# Altium schematic sheet First_Sheet.SCHDOC
size 558 x 431 mm
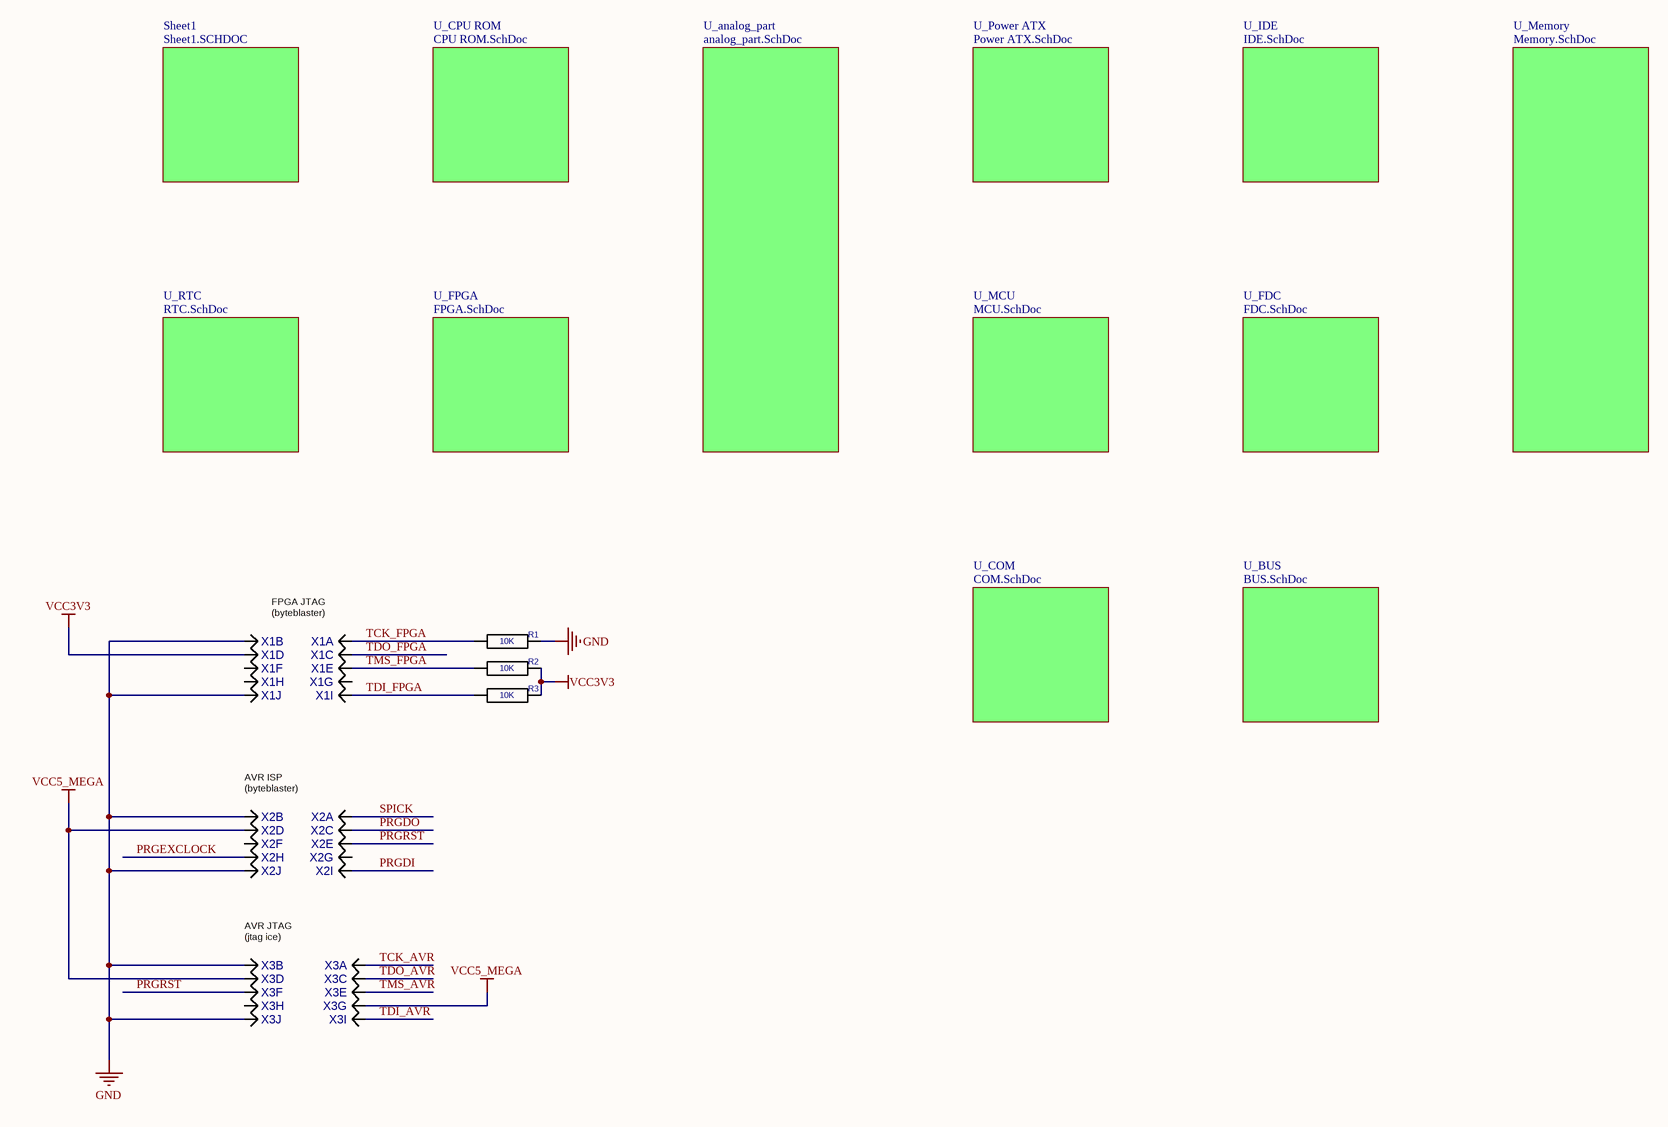
[diagram p0: First_Sheet.SCHDOC]

## Parts
R1  value 10K  [R-CHIP]  (hidden comment: RESCHIP)
R2  value 10K  [R-CHIP]  (hidden comment: RESCHIP)
R3  value 10K  [R-CHIP]  (hidden comment: RESCHIP)
X1  IDC10M  [IDC10M]  (value not drawn)  (parts A,B,C,D,E,F,G,H,I,J of 10)
X2  IDC10M  [IDC10M]  (value not drawn)  (parts A,B,C,D,E,F,G,H,I,J of 10)
X3  IDC10M  [IDC10M]  (value not drawn)  (parts A,B,C,D,E,F,G,H,I,J of 10)

## Sub-sheets
Sheet1 = Sheet1.SCHDOC: no entries
U_analog_part = analog_part.SchDoc: no entries
U_BUS = BUS.SchDoc: no entries
U_COM = COM.SchDoc: no entries
U_CPU ROM = CPU ROM.SchDoc: no entries
U_FDC = FDC.SchDoc: no entries
U_FPGA = FPGA.SchDoc: no entries
U_IDE = IDE.SchDoc: no entries
U_MCU = MCU.SchDoc: no entries
U_Memory = Memory.SchDoc: no entries
U_Power ATX = Power ATX.SchDoc: no entries
U_RTC = RTC.SchDoc: no entries

## Nets
GND: R1.2(i/o1) X1.2 X1.10 X2.2 X2.10 X3.2 X3.10
VCC3V3: R2.2(i/o1) R3.2(i/o1) X1.4
VCC5_MEGA: X2.4 X3.4 X3.7
~{PRGRST}: X2.5 X3.6
PRGDI: X2.9
PRGDO: X2.3
PRGEXCLOCK: X2.8
SPICK: X2.1
TCK_AVR: X3.1
TCK_FPGA: R1.1(i/o) X1.1
TDI_AVR: X3.9
TDI_FPGA: R3.1(i/o) X1.9
TDO_AVR: X3.3
TDO_FPGA: X1.3
TMS_AVR: X3.5
TMS_FPGA: R2.1(i/o) X1.5

Not connected (* = marked no-connect by the designer): X1 6 7 8; X2 6 7; X3 8

## Notes on the sheet
- (near X1) FPGA JTAG
  (byteblaster)
- (near X2) AVR ISP
  (byteblaster)
- (near X3) AVR JTAG
  (jtag ice)

## Library data of the parts
X1-X3 = IDC10M: Value: *